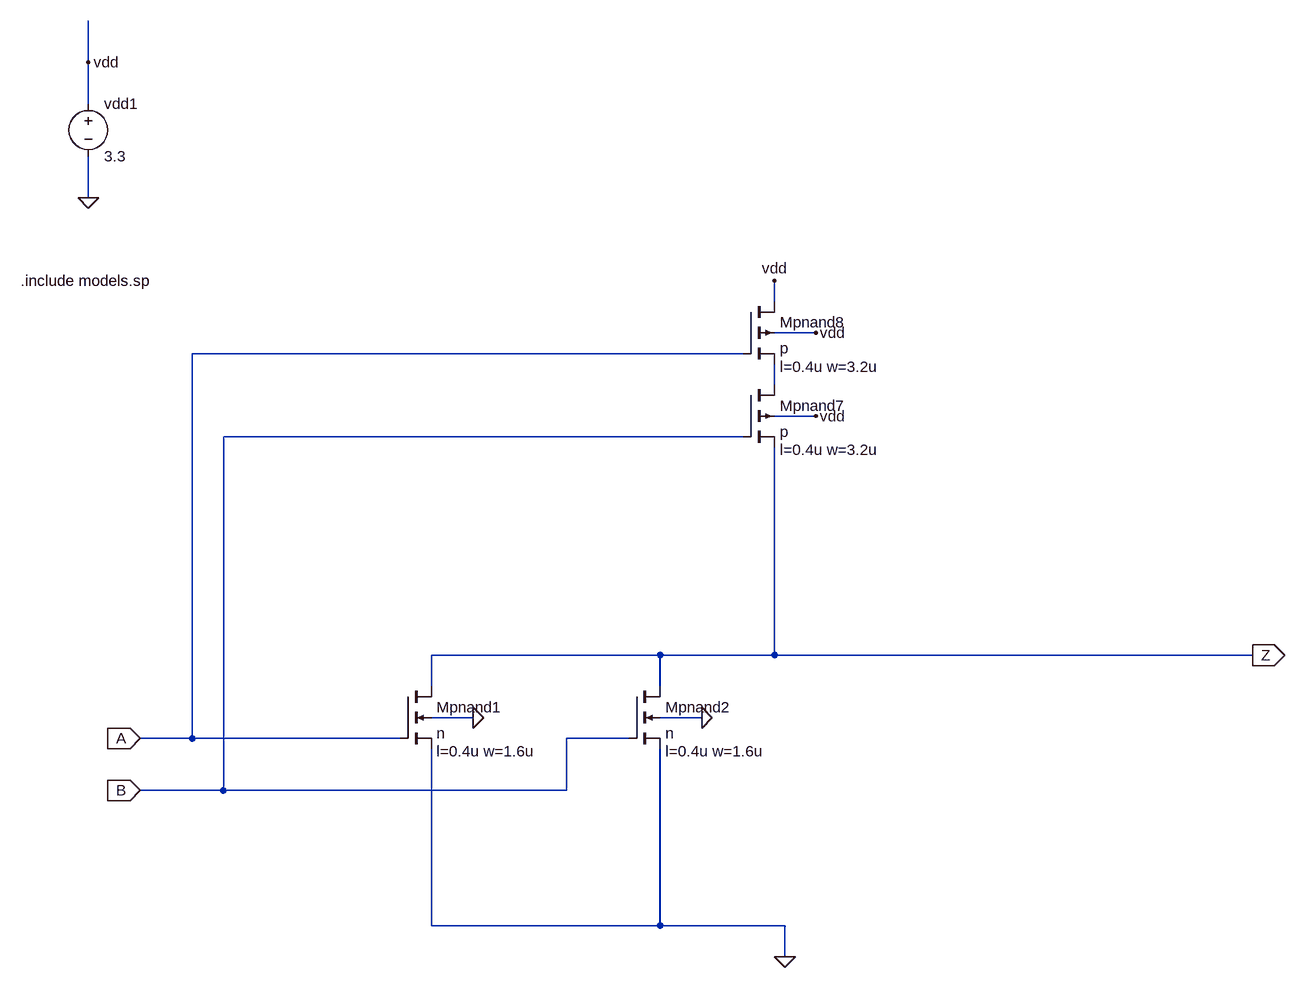
[diagram p0: schematic nor2.asc]
nor2.asc, the LTspice schematic file:
Version 4
SHEET 1 1096 680
WIRE -768 -736 -768 -800
WIRE -768 -672 -768 -736
WIRE -768 -528 -768 -592
WIRE 288 -368 288 -400
WIRE 352 -320 288 -320
WIRE 240 -288 -608 -288
WIRE 288 -240 288 -272
WIRE 352 -192 288 -192
WIRE 240 -160 -560 -160
WIRE 112 176 -240 176
WIRE 288 176 288 -144
WIRE 288 176 112 176
WIRE 1024 176 288 176
WIRE -240 224 -240 176
WIRE 112 224 112 176
WIRE -176 272 -240 272
WIRE 176 272 112 272
WIRE -608 304 -608 -288
WIRE -608 304 -688 304
WIRE -288 304 -608 304
WIRE 64 304 -32 304
WIRE -560 384 -560 -160
WIRE -560 384 -688 384
WIRE -32 384 -32 304
WIRE -32 384 -560 384
WIRE -240 592 -240 320
WIRE 112 592 112 320
WIRE 112 592 -240 592
WIRE 304 592 112 592
WIRE 304 640 304 592
FLAG -688 304 A
IOPIN -688 304 In
FLAG -688 384 B
IOPIN -688 384 In
FLAG 1024 176 Z
IOPIN 1024 176 Out
FLAG -768 -528 0
FLAG -768 -736 vdd
FLAG -176 272 0
FLAG 176 272 0
FLAG 352 -192 vdd
FLAG 352 -320 vdd
FLAG 288 -400 vdd
FLAG 304 640 0
SYMBOL voltage -768 -688 R0
WINDOW 123 0 0 Left 0
WINDOW 39 0 0 Left 0
SYMATTR InstName vdd1
SYMATTR Value 3.3
SYMBOL nmos4 -288 224 R0
WINDOW 123 56 100 Left 2
SYMATTR Value2 l=0.4u w=1.6u
SYMATTR InstName Mpnand1
SYMATTR Value n
SYMBOL nmos4 64 224 R0
WINDOW 123 56 100 Left 2
SYMATTR Value2 l=0.4u w=1.6u
SYMATTR InstName Mpnand2
SYMATTR Value n
SYMBOL pmos4 240 -240 R0
WINDOW 123 56 100 Left 2
SYMATTR Value2 l=0.4u w=3.2u
SYMATTR InstName Mpnand7
SYMATTR Value p
SYMBOL pmos4 240 -368 R0
WINDOW 123 56 100 Left 2
SYMATTR Value2 l=0.4u w=3.2u
SYMATTR InstName Mpnand8
SYMATTR Value p
TEXT -872 -400 Left 2 !.include models.sp

The netlist it stands for:
* nor2.asc
vdd1 vdd 0 3.3
Mpnand1 Z A 0 0 n l=0.4u w=1.6u
Mpnand2 Z B 0 0 n l=0.4u w=1.6u
Mpnand7 N001 B Z vdd p l=0.4u w=3.2u
Mpnand8 vdd A N001 vdd p l=0.4u w=3.2u
.model NMOS NMOS
.model PMOS PMOS
.lib standard.mos
.include models.sp
.backanno
.end